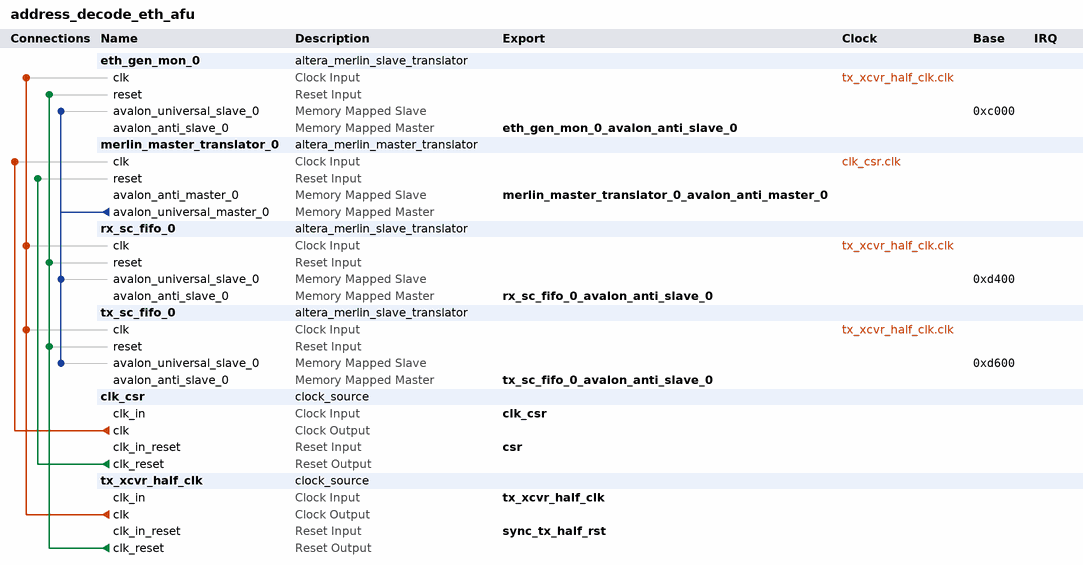
[diagram p0: system contents]
# Platform Designer (Qsys) system address_decode_eth_afu, Stratix 10 1SX280HN2F43E2VG
# Parameters at their usual value, and those the tool derives, are not listed.
package require -exact qsys 1.0
create_system address_decode_eth_afu
set_project_property DEVICE_FAMILY {Stratix 10}
set_project_property DEVICE 1SX280HN2F43E2VG

add_component eth_gen_mon_0 ip/address_decode_eth_afu/address_decode_eth_afu_eth_gen_mon.ip altera_merlin_slave_translator eth_gen_mon_0 19.1
load_component eth_gen_mon_0
set_component_parameter_value AV_ADDRESS_W 12
set_component_parameter_value AV_DATA_W 32
set_component_parameter_value UAV_DATA_W 32
set_component_parameter_value AV_BURSTCOUNT_W 4
set_component_parameter_value AV_BYTEENABLE_W 4
set_component_parameter_value UAV_BYTEENABLE_W 4
set_component_parameter_value UAV_ADDRESS_W 14
set_component_parameter_value UAV_BURSTCOUNT_W 4
set_component_parameter_value AV_READLATENCY 0
set_component_parameter_value AV_SETUP_WAIT 0
set_component_parameter_value AV_WRITE_WAIT 0
set_component_parameter_value AV_READ_WAIT 1
set_component_parameter_value AV_DATA_HOLD 0
set_component_parameter_value AV_TIMING_UNITS 1
set_component_parameter_value USE_READDATA 1
set_component_parameter_value USE_WRITEDATA 1
set_component_parameter_value USE_READ 1
set_component_parameter_value USE_WRITE 1
set_component_parameter_value USE_BEGINBURSTTRANSFER 0
set_component_parameter_value USE_BEGINTRANSFER 0
set_component_parameter_value USE_BYTEENABLE 0
set_component_parameter_value USE_CHIPSELECT 0
set_component_parameter_value USE_ADDRESS 1
set_component_parameter_value USE_BURSTCOUNT 0
set_component_parameter_value USE_READDATAVALID 0
set_component_parameter_value USE_WAITREQUEST 1
set_component_parameter_value USE_WRITEBYTEENABLE 0
set_component_parameter_value USE_LOCK 0
set_component_parameter_value USE_AV_CLKEN 0
set_component_parameter_value USE_UAV_CLKEN 0
set_component_parameter_value USE_OUTPUTENABLE 0
set_component_parameter_value USE_DEBUGACCESS 0
set_component_parameter_value USE_READRESPONSE 0
set_component_parameter_value USE_WRITERESPONSE 0
set_component_parameter_value AV_SYMBOLS_PER_WORD 4
set_component_parameter_value AV_ADDRESS_SYMBOLS 1
set_component_parameter_value AV_BURSTCOUNT_SYMBOLS 1
set_component_parameter_value AV_CONSTANT_BURST_BEHAVIOR 0
set_component_parameter_value UAV_CONSTANT_BURST_BEHAVIOR 0
set_component_parameter_value AV_REQUIRE_UNALIGNED_ADDRESSES 0
set_component_parameter_value AV_LINEWRAPBURSTS 0
set_component_parameter_value AV_MAX_PENDING_READ_TRANSACTIONS 64
set_component_parameter_value AV_MAX_PENDING_WRITE_TRANSACTIONS 0
set_component_parameter_value AV_BURSTBOUNDARIES 0
set_component_parameter_value AV_INTERLEAVEBURSTS 0
set_component_parameter_value AV_BITS_PER_SYMBOL 8
set_component_parameter_value AV_ISBIGENDIAN 0
set_component_parameter_value AV_ADDRESSGROUP 0
set_component_parameter_value UAV_ADDRESSGROUP 0
set_component_parameter_value AV_REGISTEROUTGOINGSIGNALS 0
set_component_parameter_value AV_REGISTERINCOMINGSIGNALS 0
set_component_parameter_value AV_ALWAYSBURSTMAXBURST 0
set_component_parameter_value CHIPSELECT_THROUGH_READLATENCY 0
set_component_parameter_value CLOCK_RATE 156250000
set_component_parameter_value AV_READ_WAIT_CYCLES 1
set_component_parameter_value AV_WRITE_WAIT_CYCLES 0
set_component_parameter_value AV_SETUP_WAIT_CYCLES 0
set_component_parameter_value AV_DATA_HOLD_CYCLES 0
set_component_parameter_value WAITREQUEST_ALLOWANCE 0
set_component_parameter_value SYNC_RESET 0
save_component

add_component merlin_master_translator_0 ip/address_decode_eth_afu/address_decode_eth_afu_merlin_master_translator_0.ip altera_merlin_master_translator merlin_master_translator_0 19.1
load_component merlin_master_translator_0
set_component_parameter_value AV_ADDRESS_W 16
set_component_parameter_value AV_DATA_W 32
set_component_parameter_value AV_BURSTCOUNT_W 1
set_component_parameter_value AV_BYTEENABLE_W 4
set_component_parameter_value UAV_ADDRESS_W 32
set_component_parameter_value UAV_BURSTCOUNT_W 10
set_component_parameter_value AV_READLATENCY 0
set_component_parameter_value AV_WRITE_WAIT 0
set_component_parameter_value AV_READ_WAIT 0
set_component_parameter_value AV_DATA_HOLD 0
set_component_parameter_value AV_SETUP_WAIT 0
set_component_parameter_value USE_READDATA 1
set_component_parameter_value USE_WRITEDATA 1
set_component_parameter_value USE_READ 1
set_component_parameter_value USE_WRITE 1
set_component_parameter_value USE_BEGINBURSTTRANSFER 0
set_component_parameter_value USE_BEGINTRANSFER 0
set_component_parameter_value USE_BYTEENABLE 0
set_component_parameter_value USE_CHIPSELECT 0
set_component_parameter_value USE_ADDRESS 1
set_component_parameter_value USE_BURSTCOUNT 0
set_component_parameter_value USE_DEBUGACCESS 0
set_component_parameter_value USE_CLKEN 0
set_component_parameter_value USE_READDATAVALID 0
set_component_parameter_value USE_WAITREQUEST 1
set_component_parameter_value USE_LOCK 0
set_component_parameter_value USE_READRESPONSE 0
set_component_parameter_value USE_WRITERESPONSE 0
set_component_parameter_value AV_SYMBOLS_PER_WORD 4
set_component_parameter_value AV_ADDRESS_SYMBOLS 0
set_component_parameter_value AV_BURSTCOUNT_SYMBOLS 0
set_component_parameter_value AV_CONSTANT_BURST_BEHAVIOR 0
set_component_parameter_value UAV_CONSTANT_BURST_BEHAVIOR 0
set_component_parameter_value AV_LINEWRAPBURSTS 0
set_component_parameter_value AV_MAX_PENDING_READ_TRANSACTIONS 0
set_component_parameter_value AV_BURSTBOUNDARIES 0
set_component_parameter_value AV_INTERLEAVEBURSTS 0
set_component_parameter_value AV_BITS_PER_SYMBOL 8
set_component_parameter_value AV_ISBIGENDIAN 0
set_component_parameter_value AV_ADDRESSGROUP 0
set_component_parameter_value UAV_ADDRESSGROUP 0
set_component_parameter_value AV_REGISTEROUTGOINGSIGNALS 0
set_component_parameter_value AV_REGISTERINCOMINGSIGNALS 0
set_component_parameter_value AV_ALWAYSBURSTMAXBURST 0
set_component_parameter_value SYNC_RESET 0
set_component_parameter_value WAITREQUEST_ALLOWANCE 0
save_component

add_component rx_sc_fifo_0 ip/address_decode_eth_afu/address_decode_eth_afu_rx_sc_fifo.ip altera_merlin_slave_translator rx_sc_fifo_0 19.1
load_component rx_sc_fifo_0
set_component_parameter_value AV_ADDRESS_W 3
set_component_parameter_value AV_DATA_W 32
set_component_parameter_value UAV_DATA_W 32
set_component_parameter_value AV_BURSTCOUNT_W 4
set_component_parameter_value AV_BYTEENABLE_W 4
set_component_parameter_value UAV_BYTEENABLE_W 4
set_component_parameter_value UAV_ADDRESS_W 5
set_component_parameter_value UAV_BURSTCOUNT_W 4
set_component_parameter_value AV_READLATENCY 0
set_component_parameter_value AV_SETUP_WAIT 0
set_component_parameter_value AV_WRITE_WAIT 0
set_component_parameter_value AV_READ_WAIT 1
set_component_parameter_value AV_DATA_HOLD 0
set_component_parameter_value AV_TIMING_UNITS 1
set_component_parameter_value USE_READDATA 1
set_component_parameter_value USE_WRITEDATA 1
set_component_parameter_value USE_READ 1
set_component_parameter_value USE_WRITE 1
set_component_parameter_value USE_BEGINBURSTTRANSFER 0
set_component_parameter_value USE_BEGINTRANSFER 0
set_component_parameter_value USE_BYTEENABLE 0
set_component_parameter_value USE_CHIPSELECT 0
set_component_parameter_value USE_ADDRESS 1
set_component_parameter_value USE_BURSTCOUNT 0
set_component_parameter_value USE_READDATAVALID 0
set_component_parameter_value USE_WAITREQUEST 0
set_component_parameter_value USE_WRITEBYTEENABLE 0
set_component_parameter_value USE_LOCK 0
set_component_parameter_value USE_AV_CLKEN 0
set_component_parameter_value USE_UAV_CLKEN 0
set_component_parameter_value USE_OUTPUTENABLE 0
set_component_parameter_value USE_DEBUGACCESS 0
set_component_parameter_value USE_READRESPONSE 0
set_component_parameter_value USE_WRITERESPONSE 0
set_component_parameter_value AV_SYMBOLS_PER_WORD 4
set_component_parameter_value AV_ADDRESS_SYMBOLS 0
set_component_parameter_value AV_BURSTCOUNT_SYMBOLS 0
set_component_parameter_value AV_CONSTANT_BURST_BEHAVIOR 0
set_component_parameter_value UAV_CONSTANT_BURST_BEHAVIOR 0
set_component_parameter_value AV_REQUIRE_UNALIGNED_ADDRESSES 0
set_component_parameter_value AV_LINEWRAPBURSTS 0
set_component_parameter_value AV_MAX_PENDING_READ_TRANSACTIONS 64
set_component_parameter_value AV_MAX_PENDING_WRITE_TRANSACTIONS 0
set_component_parameter_value AV_BURSTBOUNDARIES 0
set_component_parameter_value AV_INTERLEAVEBURSTS 0
set_component_parameter_value AV_BITS_PER_SYMBOL 8
set_component_parameter_value AV_ISBIGENDIAN 0
set_component_parameter_value AV_ADDRESSGROUP 0
set_component_parameter_value UAV_ADDRESSGROUP 0
set_component_parameter_value AV_REGISTEROUTGOINGSIGNALS 0
set_component_parameter_value AV_REGISTERINCOMINGSIGNALS 0
set_component_parameter_value AV_ALWAYSBURSTMAXBURST 0
set_component_parameter_value CHIPSELECT_THROUGH_READLATENCY 0
set_component_parameter_value CLOCK_RATE 156250000
set_component_parameter_value AV_READ_WAIT_CYCLES 1
set_component_parameter_value AV_WRITE_WAIT_CYCLES 0
set_component_parameter_value AV_SETUP_WAIT_CYCLES 0
set_component_parameter_value AV_DATA_HOLD_CYCLES 0
set_component_parameter_value WAITREQUEST_ALLOWANCE 0
set_component_parameter_value SYNC_RESET 0
save_component

add_component tx_sc_fifo_0 ip/address_decode_eth_afu/address_decode_eth_afu_tx_sc_fifo.ip altera_merlin_slave_translator tx_sc_fifo_0 19.1
load_component tx_sc_fifo_0
set_component_parameter_value AV_ADDRESS_W 3
set_component_parameter_value AV_DATA_W 32
set_component_parameter_value UAV_DATA_W 32
set_component_parameter_value AV_BURSTCOUNT_W 4
set_component_parameter_value AV_BYTEENABLE_W 4
set_component_parameter_value UAV_BYTEENABLE_W 4
set_component_parameter_value UAV_ADDRESS_W 5
set_component_parameter_value UAV_BURSTCOUNT_W 4
set_component_parameter_value AV_READLATENCY 0
set_component_parameter_value AV_SETUP_WAIT 0
set_component_parameter_value AV_WRITE_WAIT 0
set_component_parameter_value AV_READ_WAIT 1
set_component_parameter_value AV_DATA_HOLD 0
set_component_parameter_value AV_TIMING_UNITS 1
set_component_parameter_value USE_READDATA 1
set_component_parameter_value USE_WRITEDATA 1
set_component_parameter_value USE_READ 1
set_component_parameter_value USE_WRITE 1
set_component_parameter_value USE_BEGINBURSTTRANSFER 0
set_component_parameter_value USE_BEGINTRANSFER 0
set_component_parameter_value USE_BYTEENABLE 0
set_component_parameter_value USE_CHIPSELECT 0
set_component_parameter_value USE_ADDRESS 1
set_component_parameter_value USE_BURSTCOUNT 0
set_component_parameter_value USE_READDATAVALID 0
set_component_parameter_value USE_WAITREQUEST 0
set_component_parameter_value USE_WRITEBYTEENABLE 0
set_component_parameter_value USE_LOCK 0
set_component_parameter_value USE_AV_CLKEN 0
set_component_parameter_value USE_UAV_CLKEN 0
set_component_parameter_value USE_OUTPUTENABLE 0
set_component_parameter_value USE_DEBUGACCESS 0
set_component_parameter_value USE_READRESPONSE 0
set_component_parameter_value USE_WRITERESPONSE 0
set_component_parameter_value AV_SYMBOLS_PER_WORD 4
set_component_parameter_value AV_ADDRESS_SYMBOLS 0
set_component_parameter_value AV_BURSTCOUNT_SYMBOLS 0
set_component_parameter_value AV_CONSTANT_BURST_BEHAVIOR 0
set_component_parameter_value UAV_CONSTANT_BURST_BEHAVIOR 0
set_component_parameter_value AV_REQUIRE_UNALIGNED_ADDRESSES 0
set_component_parameter_value AV_LINEWRAPBURSTS 0
set_component_parameter_value AV_MAX_PENDING_READ_TRANSACTIONS 64
set_component_parameter_value AV_MAX_PENDING_WRITE_TRANSACTIONS 0
set_component_parameter_value AV_BURSTBOUNDARIES 0
set_component_parameter_value AV_INTERLEAVEBURSTS 0
set_component_parameter_value AV_BITS_PER_SYMBOL 8
set_component_parameter_value AV_ISBIGENDIAN 0
set_component_parameter_value AV_ADDRESSGROUP 0
set_component_parameter_value UAV_ADDRESSGROUP 0
set_component_parameter_value AV_REGISTEROUTGOINGSIGNALS 0
set_component_parameter_value AV_REGISTERINCOMINGSIGNALS 0
set_component_parameter_value AV_ALWAYSBURSTMAXBURST 0
set_component_parameter_value CHIPSELECT_THROUGH_READLATENCY 0
set_component_parameter_value CLOCK_RATE 156250000
set_component_parameter_value AV_READ_WAIT_CYCLES 1
set_component_parameter_value AV_WRITE_WAIT_CYCLES 0
set_component_parameter_value AV_SETUP_WAIT_CYCLES 0
set_component_parameter_value AV_DATA_HOLD_CYCLES 0
set_component_parameter_value WAITREQUEST_ALLOWANCE 0
set_component_parameter_value SYNC_RESET 0
save_component

add_component clk_csr ip/address_decode_eth_afu/address_decode_eth_afu_clk_csr.ip clock_source clk_csr 
load_component clk_csr
set_component_parameter_value clockFrequency 125000000
set_component_parameter_value resetSynchronousEdges DEASSERT
save_component

add_component tx_xcvr_half_clk ip/address_decode_eth_afu/address_decode_eth_afu_tx_xcvr_half_clk.ip clock_source tx_xcvr_half_clk 
load_component tx_xcvr_half_clk
set_component_parameter_value clockFrequency 156250000
save_component

# connections
add_connection clk_csr.clk merlin_master_translator_0.clk clock
add_connection tx_xcvr_half_clk.clk eth_gen_mon_0.clk clock
add_connection tx_xcvr_half_clk.clk rx_sc_fifo_0.clk clock
add_connection tx_xcvr_half_clk.clk tx_sc_fifo_0.clk clock
add_connection clk_csr.clk_reset merlin_master_translator_0.reset reset
add_connection tx_xcvr_half_clk.clk_reset eth_gen_mon_0.reset reset
add_connection tx_xcvr_half_clk.clk_reset rx_sc_fifo_0.reset reset
add_connection tx_xcvr_half_clk.clk_reset tx_sc_fifo_0.reset reset
add_connection merlin_master_translator_0.avalon_universal_master_0 eth_gen_mon_0.avalon_universal_slave_0 avalon
set_connection_parameter_value merlin_master_translator_0.avalon_universal_master_0/eth_gen_mon_0.avalon_universal_slave_0 baseAddress 0xc000
add_connection merlin_master_translator_0.avalon_universal_master_0 rx_sc_fifo_0.avalon_universal_slave_0 avalon
set_connection_parameter_value merlin_master_translator_0.avalon_universal_master_0/rx_sc_fifo_0.avalon_universal_slave_0 baseAddress 0xd400
add_connection merlin_master_translator_0.avalon_universal_master_0 tx_sc_fifo_0.avalon_universal_slave_0 avalon
set_connection_parameter_value merlin_master_translator_0.avalon_universal_master_0/tx_sc_fifo_0.avalon_universal_slave_0 baseAddress 0xd600

# exported interfaces
add_interface clk_csr clock sink
set_interface_property clk_csr EXPORT_OF clk_csr.clk_in
add_interface csr reset sink
set_interface_property csr EXPORT_OF clk_csr.clk_in_reset
add_interface eth_gen_mon_0_avalon_anti_slave_0 avalon master
set_interface_property eth_gen_mon_0_avalon_anti_slave_0 EXPORT_OF eth_gen_mon_0.avalon_anti_slave_0
add_interface merlin_master_translator_0_avalon_anti_master_0 avalon slave
set_interface_property merlin_master_translator_0_avalon_anti_master_0 EXPORT_OF merlin_master_translator_0.avalon_anti_master_0
add_interface rx_sc_fifo_0_avalon_anti_slave_0 avalon master
set_interface_property rx_sc_fifo_0_avalon_anti_slave_0 EXPORT_OF rx_sc_fifo_0.avalon_anti_slave_0
add_interface sync_tx_half_rst reset sink
set_interface_property sync_tx_half_rst EXPORT_OF tx_xcvr_half_clk.clk_in_reset
add_interface tx_sc_fifo_0_avalon_anti_slave_0 avalon master
set_interface_property tx_sc_fifo_0_avalon_anti_slave_0 EXPORT_OF tx_sc_fifo_0.avalon_anti_slave_0
add_interface tx_xcvr_half_clk clock sink
set_interface_property tx_xcvr_half_clk EXPORT_OF tx_xcvr_half_clk.clk_in

save_system address_decode_eth_afu.qsys
